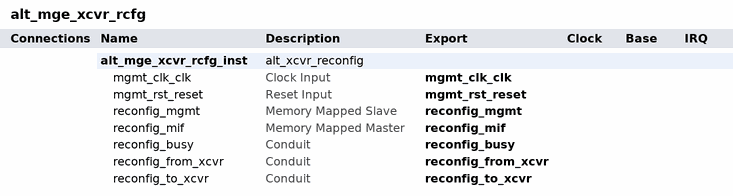
[diagram p0: system contents]
# Platform Designer (Qsys) system alt_mge_xcvr_rcfg, Arria V Unknown
# Parameters at their usual value, and those the tool derives, are not listed.
package require qsys
create_system alt_mge_xcvr_rcfg
set_project_property DEVICE_FAMILY {Arria V}
set_project_property DEVICE Unknown

add_instance alt_mge_xcvr_rcfg_inst alt_xcvr_reconfig 14.1
set_instance_property alt_mge_xcvr_rcfg_inst AUTO_EXPORT true
set_instance_parameter_value alt_mge_xcvr_rcfg_inst device_family {Arria V}
set_instance_parameter_value alt_mge_xcvr_rcfg_inst enable_adce 0
set_instance_parameter_value alt_mge_xcvr_rcfg_inst enable_analog 1
set_instance_parameter_value alt_mge_xcvr_rcfg_inst enable_mif 1
set_instance_parameter_value alt_mge_xcvr_rcfg_inst number_of_reconfig_interfaces 4

# exported interfaces
add_interface mgmt_clk_clk clock sink
set_interface_property mgmt_clk_clk EXPORT_OF alt_mge_xcvr_rcfg_inst.mgmt_clk_clk
add_interface mgmt_rst_reset reset sink
set_interface_property mgmt_rst_reset EXPORT_OF alt_mge_xcvr_rcfg_inst.mgmt_rst_reset
add_interface reconfig_busy conduit end
set_interface_property reconfig_busy EXPORT_OF alt_mge_xcvr_rcfg_inst.reconfig_busy
add_interface reconfig_from_xcvr conduit end
set_interface_property reconfig_from_xcvr EXPORT_OF alt_mge_xcvr_rcfg_inst.reconfig_from_xcvr
add_interface reconfig_mgmt avalon slave
set_interface_property reconfig_mgmt EXPORT_OF alt_mge_xcvr_rcfg_inst.reconfig_mgmt
add_interface reconfig_mif avalon master
set_interface_property reconfig_mif EXPORT_OF alt_mge_xcvr_rcfg_inst.reconfig_mif
add_interface reconfig_to_xcvr conduit end
set_interface_property reconfig_to_xcvr EXPORT_OF alt_mge_xcvr_rcfg_inst.reconfig_to_xcvr

set_interconnect_requirement {$system} qsys_mm.clockCrossingAdapter HANDSHAKE
set_interconnect_requirement {$system} qsys_mm.insertDefaultSlave FALSE
set_interconnect_requirement {$system} qsys_mm.maxAdditionalLatency 1

save_system alt_mge_xcvr_rcfg.qsys
